# EAGLE design ears_v40 (EAGLE 7.7.0)

## Sheet 1 of 3
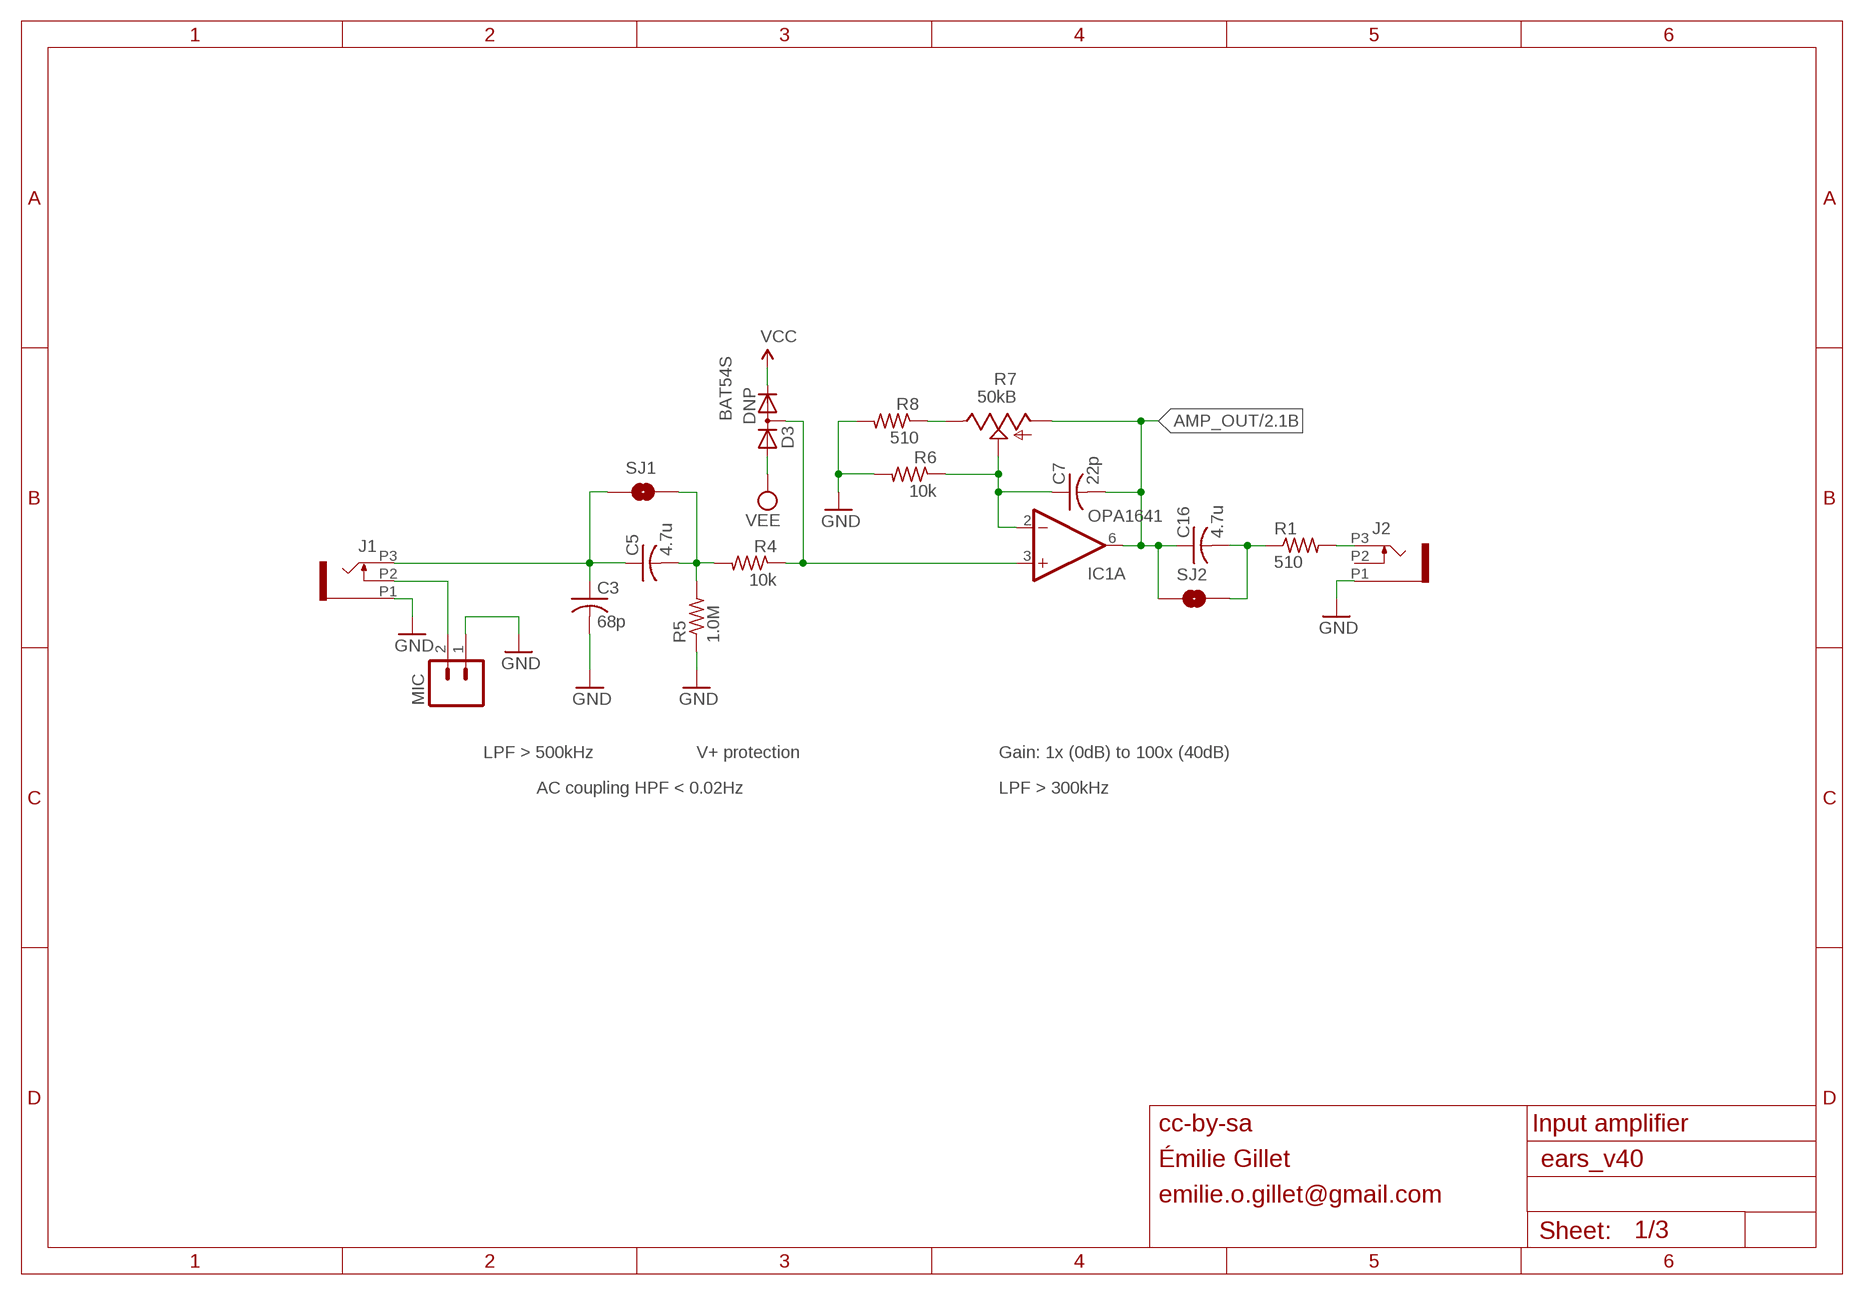
[diagram p0: schematic, sheet 1]

### Parts
C3  68p  C-USC0402  [C0402]
C5  4.7u  C-USC0603  [C0603]
C7  22p  C-USC0402  [C0402]
C16  4.7u  C-USC0603  [C0603]
D3  DNP  DIODE_2CACA-SOT23  [SOT23]
IC1  OPA1641  [MSOP8]
J1  PJ301_THONKICONN6  [WQP_PJ_301M6]
J2  PJ301_THONKICONN6  [WQP_PJ_301M6]
MIC  M02TINY  [1X02_TINY]
R1  510  R-US_R0402  [R0402]
R4  10k  R-US_R0402  [R0402]
R5  1.0M  R-US_R0402  [R0402]
R6  10k  R-US_R0402  [R0402]
R7  50kB  POT_USVERTICAL_PS  [ALPS_POT_VERTICAL_PS]
R8  510  R-US_R0402  [R0402]
SJ1  SOLDERJUMPERNC  [SJ_2S]
SJ2  SOLDERJUMPERNC  [SJ_2S]

### Nets
AMP_OUT: C7.2 C16.1 IC1.6(A:OUT) R7.P$3(A) SJ2.1 ; also sheet 2
GND: C3.2 J1.P1 J2.P1 MIC.1 R5.1 R6.2 R8.2 ; also sheet 2,3
N$2: D3.3(AC) IC1.3(A:+IN) R4.1
N$3: J2.P3 R1.2
N$4: C3.1 C5.1 J1.P3 SJ1.1
N$7: J1.P2 MIC.2
N$9: C7.1 IC1.2(A:-IN) R6.1 R7.P$2(S)
N$10: C5.2 R4.2 R5.2 SJ1.2
N$13: R7.P$1(E) R8.1
N$15: C16.2 R1.1 SJ2.2
VCC: D3.2(C) ; also sheet 2,3
VEE: D3.1(A) ; also sheet 2,3
Unconnected: J2.P2

### Notes on the sheet
- BAT54S
- LPF > 500kHz | V+ protection | Gain: 1x (0dB) to 100x (40dB)
- AC coupling HPF < 0.02Hz | LPF > 300kHz
- cc-by-sa | Input amplifier
- Émilie Gillet
- emilie.o.gillet@gmail.com

## Sheet 2 of 3
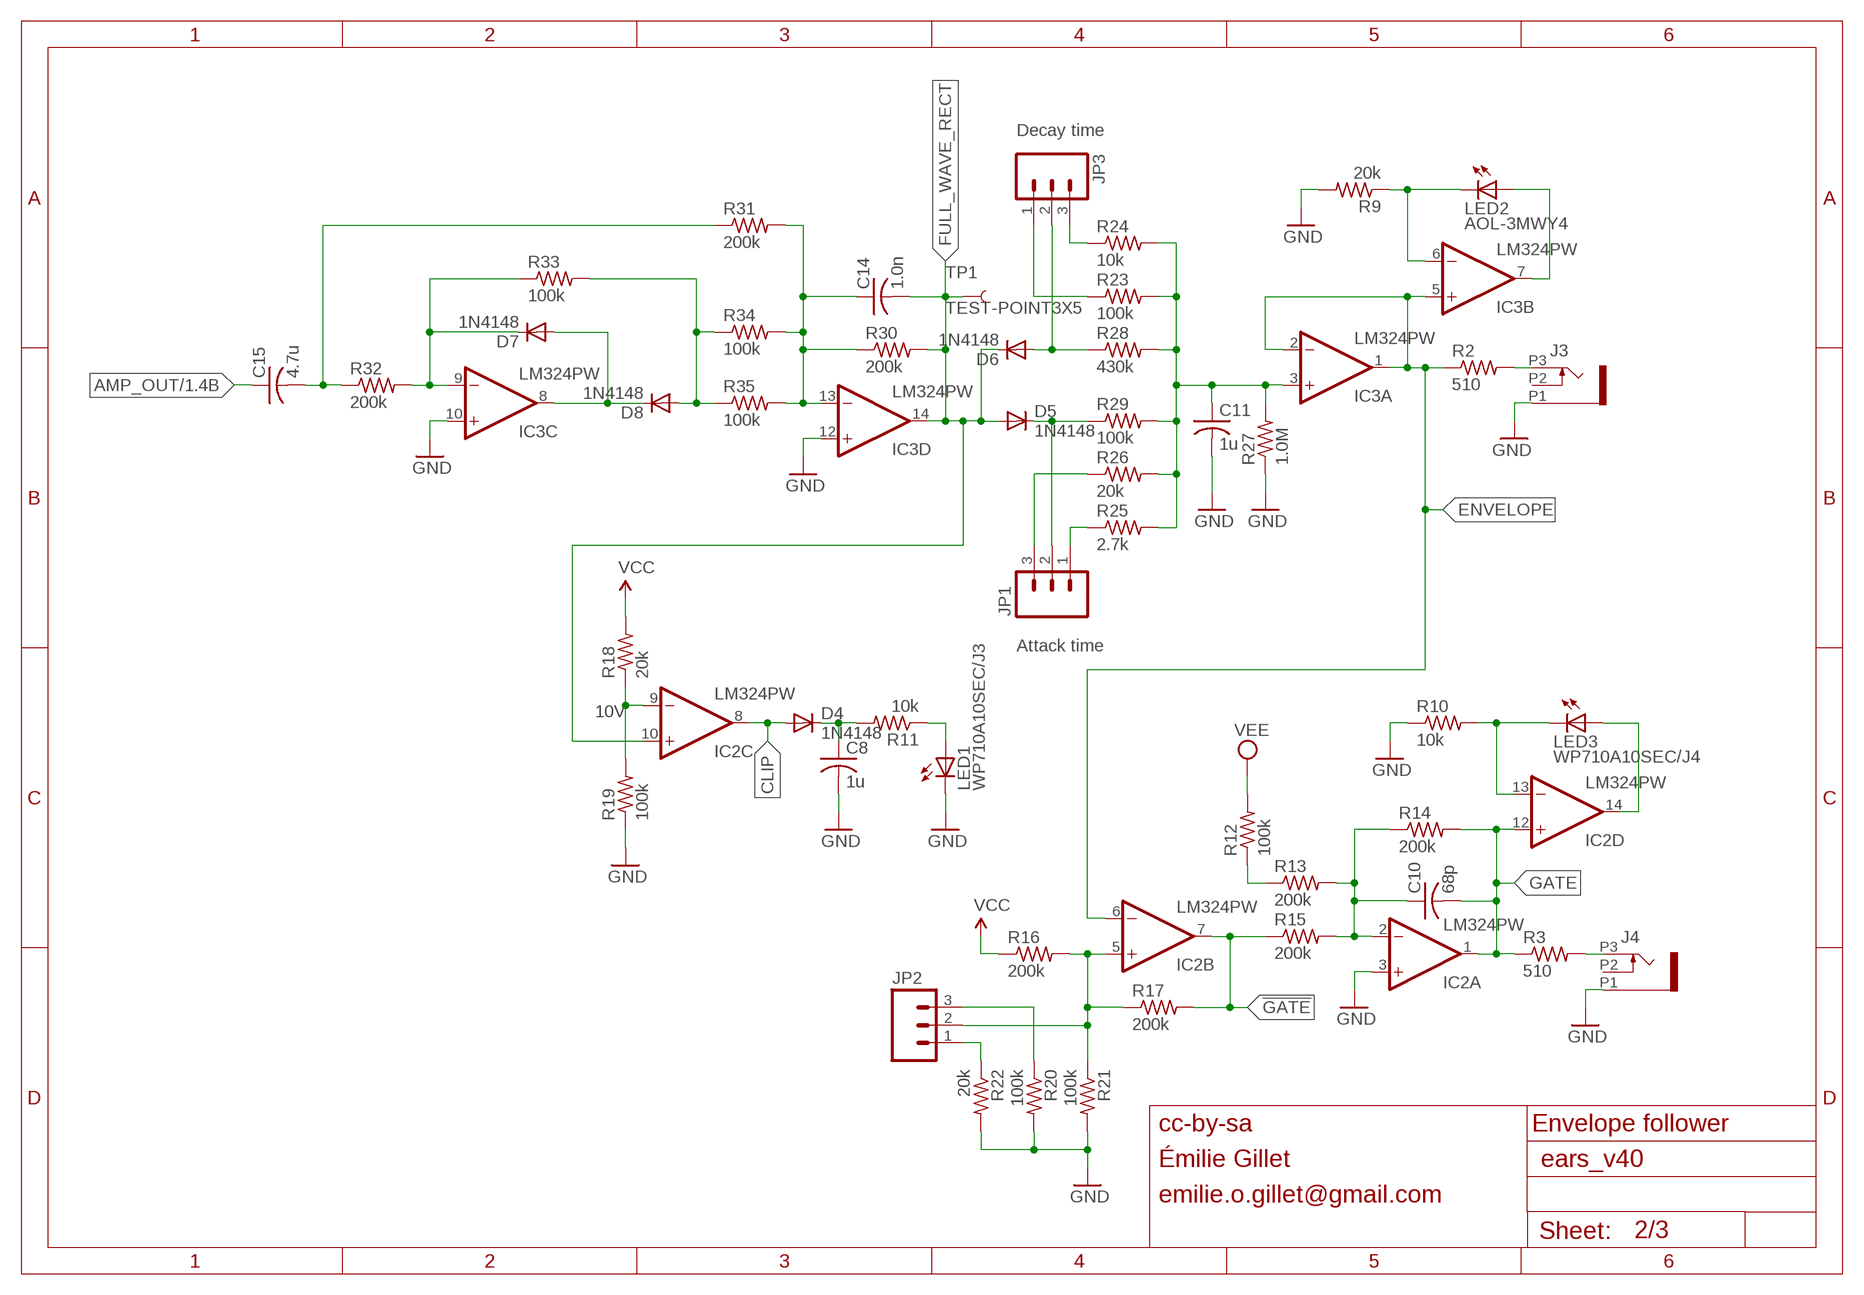
[diagram p1: schematic, sheet 2]

### Parts
C8  1u  C-USC0402  [C0402]
C10  68p  C-USC0402  [C0402]
C11  1u  C-USC0402  [C0402]
C14  1.0n  C-USC0402  [C0402]
C15  4.7u  C-USC0603  [C0603]
D4  1N4148  DIODE-SOD523  [SOD523]
D5  1N4148  DIODE-SOD523  [SOD523]
D6  1N4148  DIODE-SOD523  [SOD523]
D7  1N4148  DIODE-SOD523  [SOD523]
D8  1N4148  DIODE-SOD523  [SOD523]
IC2  LM324PW  [TSSOP14]
IC3  LM324PW  [TSSOP14]
J3  PJ301_THONKICONN6  [WQP_PJ_301M6]
J4  PJ301_THONKICONN6  [WQP_PJ_301M6]
JP1  M03PTH  [1X03]
JP2  M03PTH  [1X03]
JP3  M03PTH  [1X03]
LED1  WP710A10SEC/J3  LED3MM  [LED3MM]
LED2  AOL-3MWY4  LED3MM  [LED3MM]
LED3  WP710A10SEC/J4  LED3MM  [LED3MM]
R2  510  R-US_R0402  [R0402]
R3  510  R-US_R0402  [R0402]
R9  20k  R-US_R0402  [R0402]
R10  10k  R-US_R0402  [R0402]
R11  10k  R-US_R0402  [R0402]
R12  100k  R-US_R0402  [R0402]
R13  200k  R-US_R0402  [R0402]
R14  200k  R-US_R0402  [R0402]
R15  200k  R-US_R0402  [R0402]
R16  200k  R-US_R0402  [R0402]
R17  200k  R-US_R0402  [R0402]
R18  20k  R-US_R0402  [R0402]
R19  100k  R-US_R0402  [R0402]
R20  100k  R-US_R0402  [R0402]
R21  100k  R-US_R0402  [R0402]
R22  20k  R-US_R0402  [R0402]
R23  100k  R-US_R0402  [R0402]
R24  10k  R-US_R0402  [R0402]
R25  2.7k  R-US_R0402  [R0402]
R26  20k  R-US_R0402  [R0402]
R27  1.0M  R-US_R0402  [R0402]
R28  430k  R-US_R0402  [R0402]
R29  100k  R-US_R0402  [R0402]
R30  200k  R-US_R0402  [R0402]
R31  200k  R-US_R0402  [R0402]
R32  200k  R-US_R0402  [R0402]
R33  100k  R-US_R0402  [R0402]
R34  100k  R-US_R0402  [R0402]
R35  100k  R-US_R0402  [R0402]
TP1  TEST-POINT3X5  [PAD.03X.05]

### Nets
!GATE: IC2.7(B:OUT) R15.1 R17.2
AMP_OUT: C15.1 ; also sheet 1
AMP_OUT_AC: C15.2 R31.1 R32.1
CLIP: D4.A IC2.8(C:OUT)
ENVELOPE: IC2.6(B:-IN) IC3.1(A:OUT) IC3.2(A:-IN) IC3.5(B:+IN) R2.1
FULL_WAVE_RECT: C14.2 D5.A D6.C IC2.10(C:+IN) IC3.14(D:OUT) R30.2 TP1.P$1
GATE: C10.2 IC2.1(A:OUT) IC2.12(D:+IN) R3.1 R14.2
GND: C8.2 C11.2 IC2.3(A:+IN) IC3.10(C:+IN) IC3.12(D:+IN) J3.P1 J4.P1 LED1.K(C) R9.2 R10.1 R19.1 R20.2 R21.2 R22.2 R27.1 ; also sheet 1,3
N$5: D7.A D8.C IC3.8(C:OUT)
N$8: C10.1 IC2.2(A:-IN) R13.2 R14.1 R15.2
N$11: D7.C IC3.9(C:-IN) R32.2 R33.1
N$12: D8.A R33.2 R34.1 R35.1
N$14: C14.1 IC3.13(D:-IN) R30.1 R31.2 R34.2 R35.2
N$16: J3.P3 R2.2
N$17: IC3.6(B:-IN) LED2.K(C) R9.1
N$18: D5.C JP1.2 R29.1
N$19: C11.1 IC3.3(A:+IN) R23.2 R24.2 R25.2 R26.2 R27.2 R28.2 R29.2
N$21: JP3.3 R24.1
N$23: JP3.1 R23.1
N$24: D6.A JP3.2 R28.1
N$25: JP1.1 R25.1
N$26: JP1.3 R26.1
N$27: IC2.9(C:-IN) R18.1 R19.2
N$28: C8.1 D4.C R11.2
N$30: IC3.7(B:OUT) LED2.A
N$31: LED1.A R11.1
N$32: J4.P3 R3.2
N$33: IC2.5(B:+IN) JP2.2 R16.2 R17.1 R21.1
N$35: JP2.1 R22.1
N$36: JP2.3 R20.1
N$37: IC2.13(D:-IN) LED3.K(C) R10.2
N$38: IC2.14(D:OUT) LED3.A
N$39: R12.1 R13.1
VCC: R16.1 R18.2 ; also sheet 1,3
VEE: R12.2 ; also sheet 1,3
Unconnected: J3.P2 J4.P2

### Notes on the sheet
- Decay time
- Attack time
- 10V
- cc-by-sa | Envelope follower
- Émilie Gillet
- emilie.o.gillet@gmail.com

## Sheet 3 of 3
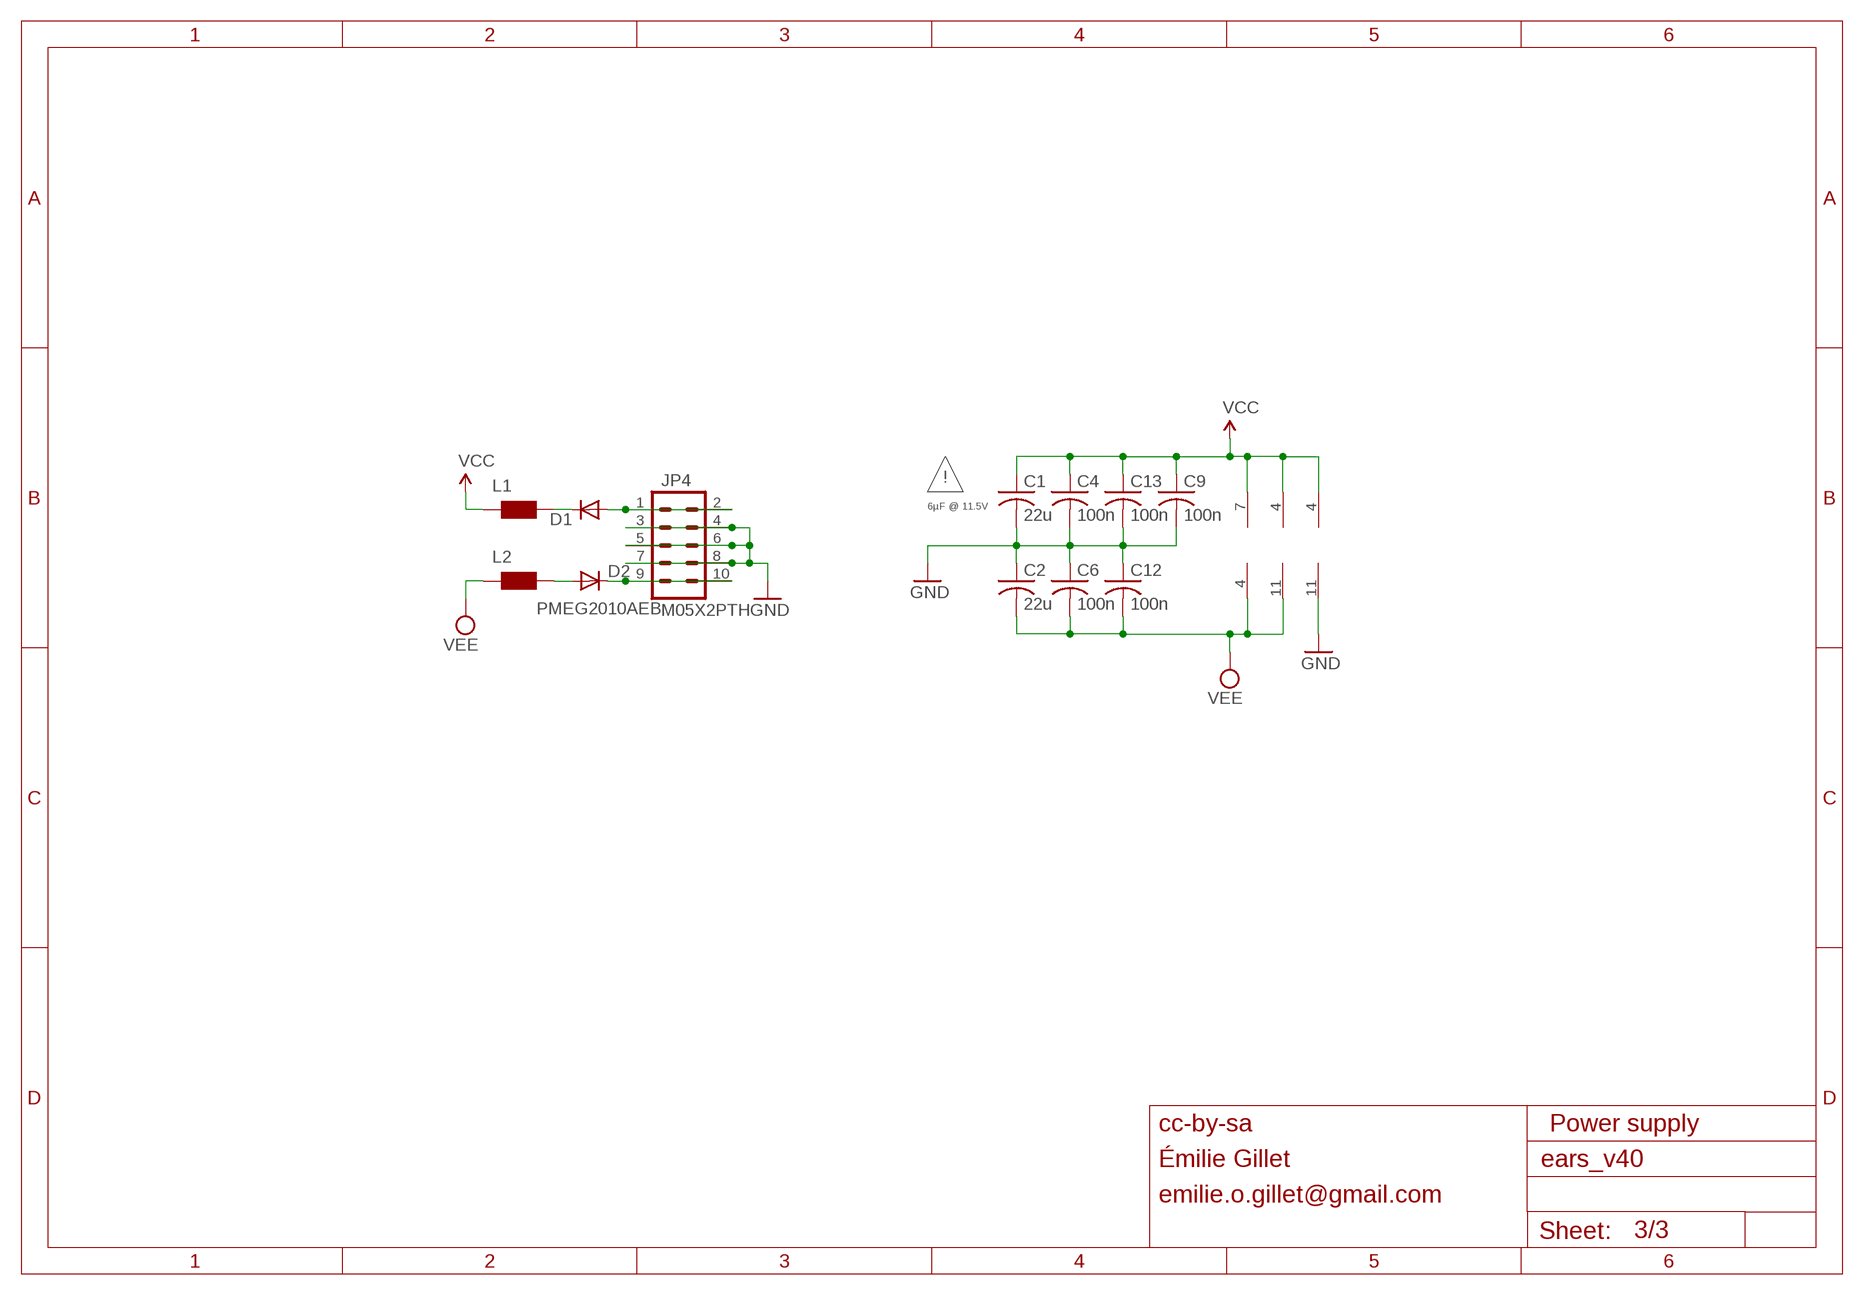
[diagram p2: schematic, sheet 3]

### Parts
C1  22u  C-USC1206  [C1206]
C2  22u  C-USC1206  [C1206]
C4  100n  C-USC0402  [C0402]
C6  100n  C-USC0402  [C0402]
C9  100n  C-USC0402  [C0402]
C12  100n  C-USC0402  [C0402]
C13  100n  C-USC0402  [C0402]
D1  PMEG2010AEB  DIODE-SOD523  [SOD523]
D2  PMEG2010AEB  DIODE-SOD523  [SOD523]
JP4  M05X2PTH  [AVR_ICSP]
L1  WE-CBF_0603  [0603]
L2  WE-CBF_0603  [0603]

### Nets
GND: C1.2 C2.1 C4.2 C6.1 C9.2 C12.1 C13.2 IC2.11(P:V-) JP4.3 JP4.4 JP4.5 JP4.6 JP4.7 JP4.8 ; also sheet 1,2
N$6: D1.A JP4.1 JP4.2
N$20: D2.C JP4.9 JP4.10
N$22: D1.C L1.2
N$44: D2.A L2.2
VCC: C1.1 C4.1 C9.1 C13.1 IC1.7(V+) IC2.4(P:V+) IC3.4(P:V+) L1.1 ; also sheet 1,2
VEE: C2.2 C6.2 C12.2 IC1.4(V-) IC3.11(P:V-) L2.1 ; also sheet 1,2

### Notes on the sheet
- !
- 6µF @ 11.5V
- cc-by-sa | Power supply
- Émilie Gillet
- emilie.o.gillet@gmail.com

## Library data of the parts
C1-C16 = rcl:C-US: CAPACITOR, American symbol
D1 D2 D4-D8 = diode:DIODE-: DIODE
D3 = diode:DIODE_2CACA-: 2 Diodes - Cathode-Anode|Cathode-Anode
IC1 = og-ics:OPA1641
IC2 IC3 = og-ics:LM324: OP AMP
J1-J4 = og-pj301:PJ301_THONKICONN
JP1-JP3 = SparkFun:M03: Header 3 Standard 3-pin 0.1" header. Use with straight break away headers (SKU : PRT-00116), right angle break away headers (PRT-00553), swiss pins (PRT-00743), machine pins (PRT-00117), and female headers (PRT-00115). Molex polarized connector foot print use with SKU : PRT-08232 with associated crimp pins and housings.
JP4 = og-header:M05X2: Header 5x2 Standard 10-pin dual row 0.1" header. Commonly used with AVR-ISP. Use with Spark Fun Electronics SKU: PRT-00778
L1 L2 = wuerth-elektronik:WE-CBF: SMD EMI Suppression Ferrite Beads - excellent anti-EMI properties - low DCR - impedances till 3000 ohms - rated current up to 6 A
LED1-LED3 = led:LED: LED OSRAM: - CHIPLED LG R971, LG N971, LY N971, LG Q971, LY Q971, LO R971, LY R971 LH N974, LH R974 LS Q976, LO Q976, LY Q976 LO Q996 - Hyper CHIPLED LW Q18S LB Q993, LB Q99A, LB R99A - SideLED LS A670, LO A670, LY A670, LG A670, LP A670 LB A673, LV A673, LT A673, LW A673 LH A674 LY A675 LS A676, LA A676, LO A676, LY A676, LW A676 LS A679, LY A679, LG A679 - Hyper Micro SIDELED® LS Y876, LA Y876, LO Y876, LY Y876 LT Y87S - SmartLED LW L88C, LW L88S LB L89C, LB L89S, LG L890 LS L89K, LO L89K, LY L89K LS L896, LA L896, LO L896, LY L896 - TOPLED LS T670, LO T670, LY T670, LG T670, LP T670 LSG T670, LSP T670, LSY T670, LOP T670, LYG T670 LG T671, LOG T671, LSG T671 LB T673, LV T673, LT T673, LW T673 LH T674 LS T676, LA T676, LO T676, LY T676, LB T676, LH T676, LSB T676, LW T676 LB T67C, LV T67C, LT T67C, LS T67K, LO T67K, LY T67K, LW E67C LS E67B, LA E67B, LO E67B, LY E67B, LB E67C, LV E67C, LT E67C LW T67C LS T679, LY T679, LG T679 LS T770, LO T770, LY T770, LG T770, LP T770 LB T773, LV T773, LT T773, LW T773 LH T774 LS E675, LA E675, LY E675, LS T675 LS T776, LA T776, LO T776, LY T776, LB T776 LHGB T686 LT T68C, LB T68C - Hyper Mini TOPLED® LB M676 - Mini TOPLED Santana® LG M470 LS M47K, LO M47K, LY M47K Source: http://www.osram.convergy.de LUXEON: - LUMILED® LXK2-PW12-R00, LXK2-PW12-S00, LXK2-PW14-U00, LXK2-PW14-V00 LXK2-PM12-R00, LXK2-PM12-S00, LXK2-PM14-U00 LXK2-PE12-Q00, LXK2-PE12-R00, LXK2-PE12-S00, LXK2-PE14-T00, LXK2-PE14-U00 LXK2-PB12-K00, LXK2-PB12-L00, LXK2-PB12-M00, LXK2-PB14-N00, LXK2-PB14-P00, LXK2-PB14-Q00 LXK2-PR12-L00, LXK2-PR12-M00, LXK2-PR14-Q00, LXK2-PR14-R00 LXK2-PD12-Q00, LXK2-PD12-R00, LXK2-PD12-S00 LXK2-PH12-R00, LXK2-PH12-S00 LXK2-PL12-P00, LXK2-PL12-Q00, LXK2-PL12-R00 Source: www.luxeon.com KINGBRIGHT: KA-3528ASYC Source: www.kingbright.com
MIC = og-header:M02: Header 2 Standard 2-pin 0.1" header. Use with straight break away headers (SKU : PRT-00116), right angle break away headers (PRT-00553), swiss pins (PRT-00743), machine pins (PRT-00117), and female headers (PRT-00115). Molex polarized connector foot print use with SKU : PRT-08233 with associated crimp pins and housings.
R1-R6 R8-R35 = rcl:R-US_: RESISTOR, American symbol
R7 = og-pots:POT_US
SJ1 SJ2 = SparkFun:SOLDERJUMPER: Solder Jumper Standard SMD solder jumper. Used to automate production. Two varients : Normally Open and Normally Closed are the same, but have different paste layers. NC will have a large amount of paste and should jumper during reflow.
TP1 = SparkFun:TEST-POINT

## Board
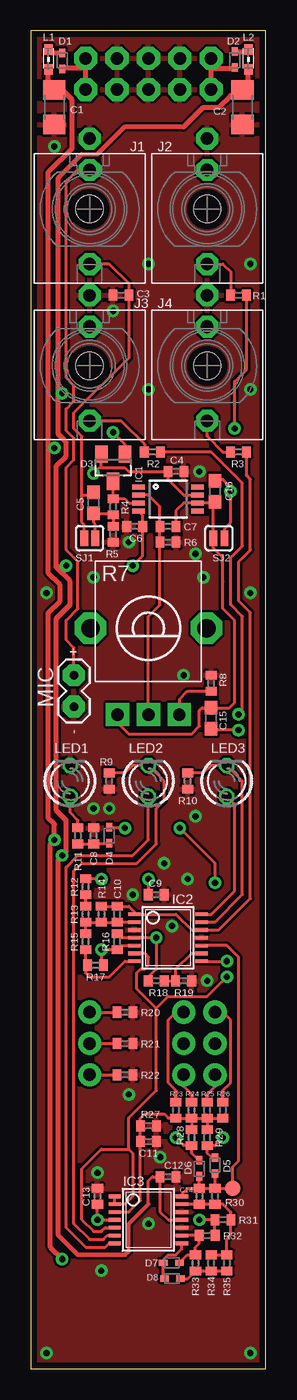
[diagram p3: board, top side]
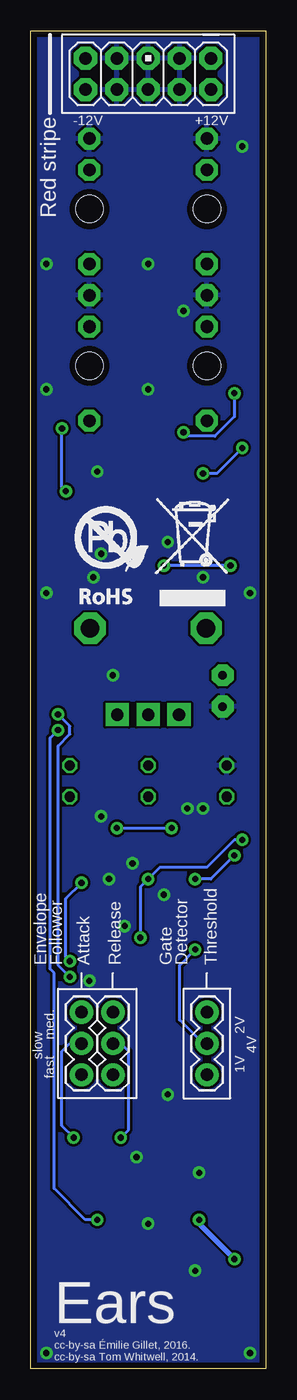
[diagram p4: board, bottom side, seen from below]

Size 19.03 x 108.43 mm. Coordinates in mm from the lower left corner, seen from the top.
Outline: 0,0 19.03,0 19.03,108.43 0,108.43 0,0
Copper layers (1*16): Top 0.035mm / dielectric 1.5mm / Bottom 0.035mm
Design rules "PCBCart-Standard *": minimum track width 8mil, minimum drill 0.4mm, track to track 8mil, track to pad 8mil, pad to pad 8mil, via to via 8mil, smd to smd 8mil, copper to edge 20mil, drill to drill 8mil, minimum pad ring 8mil, minimum via ring 10mil, stop-mask expansion 3mil, vias tented up to drill 25mil, thermal gap 8mil

### Footprints (pad centres in the part's own frame; a part is rotated, then mirrored left to right if it is on the bottom)
C1206 = smd 1.6 x 1.8: 1 -1.4,0; 2 1.4,0
C0402 = smd 0.7 x 0.9: 1 -0.65,0; 2 0.65,0
C0603 = smd 1.1 x 1: 1 -0.85,0; 2 0.85,0
SOD523 = smd 0.7 x 0.5: A 0.7,0; C -0.6,0
SOT23 = smd 1 x 1.4: 1 -0.95,-1.1; 2 0.95,-1.1; 3 0,1.1
MSOP8 = smd 0.41 x 1.02: 1 -0.975,-2.4; 2 -0.325,-2.4; 3 0.325,-2.4; 4 0.975,-2.4; 5 0.975,2.4; 6 0.325,2.4; 7 -0.325,2.4; 8 -0.975,2.4
TSSOP14 = smd 0.305 x 0.991: 1 -1.905,-2.718; 2 -1.27,-2.718; 3 -0.635,-2.718; 4 0,-2.718; 5 0.635,-2.718; 6 1.27,-2.718; 7 1.905,-2.718; 8 1.905,2.718; 9 1.27,2.718; 10 0.635,2.718; 11 0,2.718; 12 -0.635,2.718; 13 -1.27,2.718; 14 -1.905,2.718
WQP_PJ_301M6 = drill 1.016 pad 1.778 octagon: P1 0,-5.715; P2 0,-3.175; P3 0,4.445 | hole 2.2: 0,0
1X03 = drill 1.016 pad 1.88 round: 1 0,0; 2 2.54,0; 3 5.08,0
AVR_ICSP = drill 1.016 pad 1.88 octagon: 1 -1.27,5.08; 2 1.27,5.08; 3 -1.27,2.54; 4 1.27,2.54; 5 -1.27,0; 6 1.27,0; 7 -1.27,-2.54; 8 1.27,-2.54; 9 -1.27,-5.08; 10 1.27,-5.08
0603 = smd 0.85 x 0.7: 1 -0.9,0; 2 0.7,0
LED3MM = drill 0.813 octagon: A -1.27,0; K 1.27,0
1X02_TINY = drill 0.7 pad 1.778 octagon: 1 0,0; 2 2.54,0
R0402 = smd 0.7 x 0.9: 1 -0.65,0; 2 0.65,0
ALPS_POT_VERTICAL_PS = drill 1 pad 1.88 square: P$1 -2.5,7; P$2 0,7; P$3 2.5,7 | drill 1.5 pad 2.54 octagon: P$4 -4.7,0; P$5 4.7,0
SJ_2S = smd 0.635 x 1.27: 1 -0.45,0; 2 0.45,0
PAD.03X.05 = smd 1.27 x 1.27: P$1 0,0

### Placement (x,y rotation side)
C1  1.91,102.23 270 top
C2  17.14,102.23 90 top
C3  7.3,87 180 top
C4  11.75,72.71 0 top
C5  5.08,70.17 270 top
C6  8.41,68.26 0 top
C7  11.11,68.26 0 top
C8  5.08,43.18 90 top
C9  10.16,38.42 0 top
C10  6.99,36.83 90 top
C11  9.53,18.41 0 top
C12  11.11,15.56 180 top
C13  5.4,13.97 90 top
C14  13.65,13.97 90 top
C15  14.61,52.7 270 top
C16  14.92,71.12 90 top
D1  2.54,106.05 270 top
D2  16.51,106.05 90 top
D3  6.67,73.03 180 top
D4  6.35,43.18 90 top
D5  14.92,16.51 270 top
D6  13.65,16.19 90 top
D7  11.43,8.57 180 top
D8  11.43,7.3 0 top
IC1  11.11,70.48 270 top
IC2  11.11,34.92 270 top
IC3  9.53,12.06 270 top
J1  4.76,93.98 180 top
J2  14.29,93.98 180 top
J3  4.76,81.28 180 top
J4  14.29,81.28 180 top
JP1  14.92,23.81 90 bottom
JP2  4.76,23.81 90 bottom
JP3  12.38,28.89 270 bottom
JP4  9.53,104.93 270 bottom
L1  1.43,106.2 90 top
L2  17.62,106.2 90 top
LED1  3.17,47.62 90 top
LED2  9.53,47.62 90 top
LED3  15.88,47.62 90 top
MIC  3.49,53.66 90 top
R1  16.83,87 180 top
R2  9.84,74.3 180 top
R3  16.83,74.3 180 top
R4  6.67,69.85 270 top
R5  6.67,67.63 90 top
R6  11.11,66.99 0 top
R7  9.53,60.01 180 top
R8  14.61,55.56 90 top
R9  6.35,47.62 270 top
R10  12.7,47.62 90 top
R11  3.81,43.18 270 top
R12  4.45,39.05 90 top
R13  4.45,36.83 270 top
R14  5.71,36.83 90 top
R15  4.45,34.61 90 top
R16  6.99,34.61 270 top
R17  5.24,32.7 180 top
R18  10.16,31.43 180 top
R19  12.38,31.43 180 top
R20  7.62,28.89 0 top
R21  7.62,26.35 0 top
R22  7.62,23.81 0 top
R23  11.75,20.95 270 top
R24  13.02,20.95 270 top
R25  14.29,20.95 270 top
R26  15.56,20.95 270 top
R27  9.53,19.68 180 top
R28  13.02,18.73 90 top
R29  14.29,18.73 90 top
R30  14.92,13.97 90 top
R31  15.56,12.06 0 top
R32  14.29,10.79 180 top
R33  13.34,8.57 270 top
R34  14.61,8.57 90 top
R35  15.88,8.57 90 top
SJ1  4.76,67.31 0 top
SJ2  15.24,67.31 0 top
TP1  16.35,14.61 0 top
U$2  [ROHS]  16.35,61.28 0 bottom

### Tracks (layer width: path | path; a pad name or v marks a point on that pad's centre or on a via)
!GATE
  Top 0.254: R15.1 4.45,32.85 R17.2 4.45,32.56 4.45,32.07 4.76,31.75 6.35,31.75 7.62,33.02 IC2.7
AMP_OUT
  Top 0.254: R7.P$3 6.99,52.97 6.99,52.39 7.94,51.44 13.02,51.44 13.65,52.07 13.65,53.34 13.87,53.55 C15.1 16.09,53.55 16.51,53.98 16.51,60.64 15.56,61.59 15.56,63.82 15.56,65.72 14.79,66.49 SJ2.1 14.79,70.14 14.82,70.17 | C7.2 11.75,68.28 11.75,69.53 12.38,70.16 IC1.6 14.82,70.17 | 14.82,70.17 C16.1
AMP_OUT_AC  (via drill 0.5)
  Top 0.254: R31.1 14.92,12.05 | R32.1 14.91,10.82 R31.1 | R31.1 v13.65,12.06 | C15.2 14.71,51.75 v16.83,51.75
  Bottom 0.254: v16.83,51.75 17.46,51.12 17.46,32.38 17.14,32.07 17.14,14.61 14.61,12.06 v13.65,12.06
CLIP  (via drill 0.5)
  Top 0.254: IC2.8 v15.88,33.02 | D4.A 6.42,43.81 v7.62,43.81 | v12.06,43.81 14.92,40.96 v14.92,39.37
  Bottom 0.254: v15.88,33.02 16.19,33.34 16.19,38.1 v14.92,39.37 | v12.06,43.81 v7.62,43.81
ENVELOPE  (via drill 0.5)
  Top 0.254: 6.67,11.43 IC3.5 6.03,11.43 5.71,11.11 5.08,11.11 4.13,12.06 4.13,16.19 5.71,17.78 7.94,17.78 | v15.88,31.75 14.29,30.16 11.11,30.16 10.16,29.21 | IC2.6 9.21,33.66 9.53,33.34 9.53,32.7 9.21,32.38 8.89,32.38 8.57,32.07 8.57,30.8 10.16,29.21 | IC3.1 IC3.2 7.62,13.34 8.26,13.97 8.26,17.46 7.94,17.78 | v16.83,53.02 17.14,53.34 17.14,60.96 16.19,61.91 16.19,65.72 17.14,66.67 17.14,71.75 15.56,73.34 14.61,74.3 R2.1 | 7.94,17.78 7.94,20.32 10.16,22.54 10.16,29.21
  Bottom 0.254: v16.83,53.02 15.88,52.07 15.88,51.44 16.83,50.48 16.83,32.7 v15.88,31.75
FULL_WAVE_RECT
  Top 0.254: C14.2 13.64,14.61 12.7,14.61 12.24,14.15 IC3.14 | C14.2 R30.2 | C14.2 D6.C | R30.2 D5.A | R30.2 14.94,14.61 TP1.P$1 16.35,16.35 16.83,16.83 16.83,33.34 15.88,34.29 IC2.10
GATE
  Top 0.254: R14.2 C10.2 7,37.47 7.94,37.47 8.39,37.01 IC2.1 11.75,36.83 13.02,35.56 IC2.12 15.24,35.56 17.78,38.1 17.78,61.28 16.83,62.23 16.83,65.41 17.78,66.36 17.78,72.07 17.48,72.38 R3.1
GND  (via drill 0.5)
  other vias: 5.4,15.88 5.71,7.94 13.97,64.14 13.65,72.71 7.94,66.99 14.29,31.43 10.48,17.14 12.7,39.69 9.53,11.75 1.91,99.06 6.35,45.4 13.34,44.77 1.27,62.87 7.94,22.23 5.08,45.4 12.38,56.2 17.78,1.27 1.27,1.27 17.78,62.87 5.08,64.14 8.26,38.42 10.79,40.96 11.43,35.88 17.78,89.53 17.78,79.38 9.53,89.53 9.53,79.38 13.34,66.04 6.67,85.72
  pour Bottom: 0,108.43 0,0 19.05,0 19.05,108.43
  pour Top: 0,108.43 0,0 19.05,0 19.05,108.43
N$2
  Top 0.254: IC1.3 | IC1.3 7.94,70.17 7.61,70.5 R4.1 D3.3
N$3
  Top 0.254: J2.P3 15.56,89.53 16.18,88.92 R1.2
N$4
  Top 0.254: J1.P3 6.35,89.53 7.95,87.93 C3.1 7.95,81.93 3.49,77.47 3.49,76.2 4.13,75.56 4.13,70.8 | 4.13,70.8 4.13,68.58 4.31,68.39 SJ1.1 | C5.1 4.87,70.8 4.13,70.8
N$5
  Top 0.254: D8.C 10.73,7.4 D7.A 10.79,8.64 10.79,8.89 11.11,9.21 11.75,9.21 12.24,9.7 IC3.8
N$6
  Top 0.406: JP4.2 4.45,105.41 | 4.45,105.41 JP4.1 | D1.A 2.6,105.41 4.45,105.41
N$7
  Top 0.254: MIC.2 3.49,58.42 2.86,59.05 2.86,60.64 3.81,61.59 3.81,65.41 2.86,66.36 2.86,73.03 3.49,73.66 3.49,75.41 2.86,76.04 2.86,77.79 3.49,78.42 3.49,79.69 2.86,80.33 2.86,80.64 2.86,96.2 3.81,97.16 J1.P2
N$8
  Top 0.254: IC2.2 7,36.2 C10.1 R14.1 R13.2 R15.2
N$9
  Top 0.254: R7.P$2 9.53,60.96 10.46,61.9 R6.1 C7.1 10.46,69.86 9.53,70.8 IC1.2
N$10
  Top 0.254: SJ1.2 5.21,68.45 5.08,68.58 C5.2 6.55,69.32 R4.2 R5.2
N$11
  Top 0.254: IC3.9 R32.2 13.64,10.14 13.34,9.84 R33.1 12.68,9.22 D7.C
N$12
  Top 0.254: R35.1 R34.1 R33.2 13.32,7.92 12.7,7.3 D8.A
N$13
  Top 0.254: R7.P$1 12.06,53.05 12.06,54.29 12.69,54.91 R8.1
N$14
  Top 0.254: IC3.13 13.64,13.34 C14.1 R30.1 14.94,13.34 15.56,13.34 16.21,12.69 R31.2 16.21,10.81 15.88,10.48 R35.2 R34.2
N$15  (via drill 0.5)
  Top 0.254: C16.2 15.03,72.07 15.56,72.07 16.19,71.44 v16.19,71.12 16.19,68.58 15.69,68.08 SJ2.2 | v16.51,76.2 16.51,80.01 17.48,80.98 R1.1
  Bottom 0.254: v16.19,71.12 16.51,71.44 v16.51,76.2
N$16
  Top 0.254: 9.21,74.31 R2.2 9.21,74.31 | 9.21,74.31 9.21,74.93 7.3,76.83 J3.P3
N$17
  Top 0.254: IC3.6 6.19,10.79 5.87,10.48 4.76,10.48 3.49,11.75 3.49,40.32 4.13,40.96 8.57,40.96 10.16,42.55 10.16,45.4 10.79,46.04 10.79,47.62 LED2.K 8.26,48.9 7.62,48.26 6.37,48.26 R9.1
N$18  (via drill 0.5)
  Top 0.254: D5.C 14.64,17.11 14.29,17.46 R29.1 14.3,18.1 14.92,18.1 v15.56,18.73
  Bottom 0.254: v15.56,18.73 16.51,19.68 16.51,25.72 15.88,26.35 JP1.2
N$19
  Top 0.254: R24.2 R23.2 11.73,20.32 11.11,20.32 10.79,20.64 9.21,20.64 8.88,20.3 R27.2 C11.1 8.88,13.64 7.94,12.7 IC3.3 | R24.2 R28.2 | R24.2 R25.2 | R25.2 R26.2 | R25.2 R29.2
N$20
  Top 0.406: JP4.10 14.61,105.41 | 14.61,105.41 JP4.9 | D2.C 16.48,105.41 14.61,105.41
N$21
  Top 0.254: JP3.3 12.38,22.86 13.02,22.23 R24.1
N$22
  Top 0.406: L1.2 1.69,106.64 D1.C
N$23
  Top 0.254: JP3.1 11.75,28.89 11.11,28.26 11.11,23.18 11.75,22.54 R23.1
N$24  (via drill 0.5)
  Top 0.254: D6.A 13.59,16.89 13.02,17.46 R28.1 13,18.1 12.38,18.1 v11.75,18.73
  Bottom 0.254: v11.75,18.73 11.11,19.37 11.11,25.72 11.75,26.35 JP3.2
N$25
  Top 0.254: JP1.1 14.92,22.86 14.29,22.23 R25.1
N$26
  Top 0.254: JP1.3 15.56,28.89 16.19,28.26 16.19,23.18 15.56,22.54 R26.1
N$27
  Top 0.254: R18.1 R19.2 11.75,31.45 11.75,32.38 13.02,33.66 IC2.9
N$28
  Top 0.254: R11.2 C8.1 5.13,42.58 D4.C
N$30
  Top 0.254: IC3.7 6.35,10.16 6.03,9.84 4.45,9.84 2.86,11.43 2.86,40.64 3.81,41.59 8.26,41.59 9.53,42.86 LED2.A
N$31
  Top 0.254: LED1.A 3.17,45.09 3.81,44.45 R11.1
N$32
  Top 0.254: J4.P3 14.29,75.56 15.56,74.3 R3.2
N$33  (via drill 0.5)
  Top 0.254: JP2.2 R21.1 | IC2.5 7.32,34.29 R16.2 6.97,33.97 v5.71,33.97 5.71,32.88 R17.1
  Bottom 0.254: v5.71,33.97 6.99,32.7 6.99,28.26 5.08,26.35 JP2.2
N$35
  Top 0.254: JP2.1 R22.1
N$36
  Top 0.254: JP2.3 R20.1
N$37
  Top 0.254: IC2.13 14.92,36.2 17.14,38.42 17.14,47.62 LED3.K 14.61,48.9 13.97,48.26 12.71,48.26 R10.2
N$38
  Top 0.254: IC2.14 14.61,36.83 16.51,38.73 16.51,45.72 LED3.A
N$39
  Top 0.254: R13.1 R12.1
N$44
  Top 0.406: L2.2 17.46,106.75 D2.A
VCC  (via drill 0.5)
  Top 0.254: R16.1 7.32,34.92 IC2.4 v10.16,34.92 10.16,32.38 9.53,31.75 9.53,31.45 R18.2 | v9.53,39.69 9.51,39.67 C9.1 | IC3.4 v5.4,12.06 C13.1 | IC1.7 12.38,70.8 11.1,72.09 C4.1 7.94,72.71 7.62,73.03 5.71,73.03 | v5.08,72.55 5.56,73.03 5.71,73.03 | D3.2 5.71,73.03
  Top 0.406: L1.1 1.43,103.98 1.59,103.82 1.72,103.82 C1.1 2.54,103.64 3.33,102.84 3.33,98.9 1.43,97 1.43,74.61 | 1.43,74.61 v1.91,74.61 | 1.43,74.61 1.43,64.45 2.38,63.5 2.38,62.23 1.43,61.28 1.43,44.61 1.91,44.13 v1.91,42.86 1.59,42.55 1.59,9.84 v2.54,8.89
  Bottom 0.254: v1.91,74.61 3.97,72.55 4.13,72.55 v5.08,72.55 | v1.91,42.86 2.54,42.86 4.76,40.64 8.57,40.64 v9.53,39.69 10.16,39.05 v10.16,34.92
  Bottom 0.406: v2.54,8.89 5.4,11.75 v5.4,12.06
VEE  (via drill 0.5)
  Top 0.254: C12.2 10.48,15.57 | C12.2 10.48,15.54 | v5.71,39.69 5.7,39.7 R12.2 | v8.26,65.09 8.75,65.58 9.06,65.9 C6.2 | 2.06,65.09 v2.86,65.09 | 9.53,13.34 9.53,15.24 9.84,15.56 C12.2 | IC3.11 11.11,12.06 10.46,12.71 C12.2 | C6.2 8.89,68.44 | 2.22,79.06 v2.54,79.06 | IC1.4 9.06,69.16 C6.2 | v6.67,75.88 7.62,74.93 D3.1
  Top 0.305: 7.62,9.21 7.94,9.53 7.94,11.75 9.53,13.34 | 4.13,98.42 5.4,98.42
  Top 0.356: 3.81,9.21 7.62,9.21 | 2.22,96.52 4.13,98.42 | 5.4,98.42 7.62,100.65
  Top 0.381: 7.62,100.65 12.38,100.65 | 3.81,9.21 2.22,10.79
  Top 0.406: L2.1 17.62,103.98 17.46,103.82 17.33,103.82 C2.2 17.14,103.19 16.19,103.19 15.24,102.23 13.97,102.23 12.38,100.65 | 2.22,10.79 2.22,41.27 v2.54,41.59 2.86,41.91 2.86,44.45 2.06,45.24 2.06,60.8 3.17,61.91 3.17,63.82 2.06,64.93 2.06,65.09 2.06,73.18 2.86,73.98 2.86,75.09 2.22,75.72 2.22,79.06 2.22,96.52
  Bottom 0.254: v2.86,65.09 v8.26,65.09 | v2.54,41.59 4.45,39.69 v5.71,39.69 | v2.54,79.06 2.54,77.15 4.13,75.56 6.35,75.56 v6.67,75.88

### Text on the board
tPlace: + | -
bPlace: Red stripe | Threshold | Detector | Gate | Release | Attack | Follower | Envelope | 2V | 4V | med. | 1V | slow | fast
bNames: +12V | -12V | Ears | v4 | cc-by-sa Émilie Gillet, 2016. | cc-by-sa Tom Whitwell, 2014.
tDocu: DC IN | DC OUT